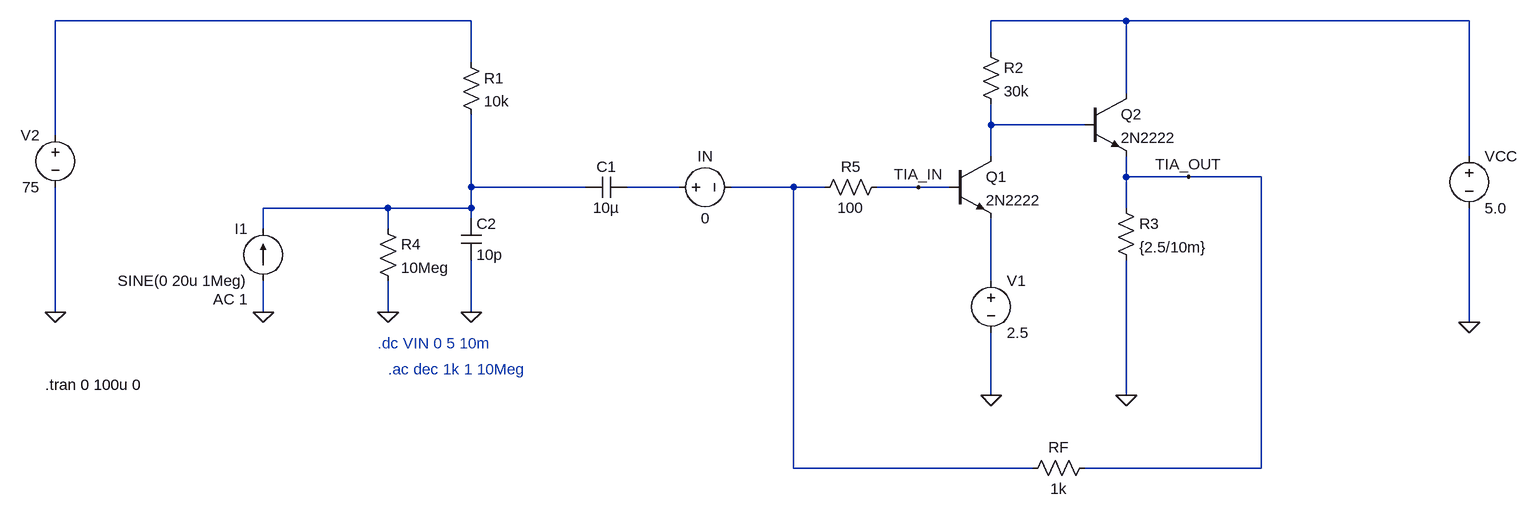
[diagram p0: schematic TIA_Improved.asc]
TIA_Improved.asc, the LTspice schematic file:
Version 4.1
SHEET 1 1100 704
WIRE -608 -32 -1248 -32
WIRE 400 -32 192 -32
WIRE 928 -32 400 -32
WIRE 192 16 192 -32
WIRE -608 32 -608 -32
WIRE 400 80 400 -32
WIRE 192 128 192 96
WIRE 336 128 192 128
WIRE -1248 144 -1248 -32
WIRE 192 176 192 128
WIRE 928 176 928 -32
WIRE 400 208 400 176
WIRE 496 208 400 208
WIRE 608 208 496 208
WIRE -608 224 -608 112
WIRE -432 224 -608 224
WIRE -288 224 -368 224
WIRE -112 224 -208 224
WIRE -64 224 -112 224
WIRE 80 224 16 224
WIRE 128 224 80 224
WIRE -736 256 -928 256
WIRE -608 256 -608 224
WIRE -608 256 -736 256
WIRE 400 256 400 208
WIRE -608 272 -608 256
WIRE -928 288 -928 256
WIRE -736 288 -736 256
WIRE 192 368 192 272
WIRE -1248 416 -1248 224
WIRE -928 416 -928 368
WIRE -736 416 -736 368
WIRE -608 416 -608 336
WIRE 928 432 928 256
WIRE 192 544 192 448
WIRE 400 544 400 336
WIRE -112 656 -112 224
WIRE 256 656 -112 656
WIRE 608 656 608 208
WIRE 608 656 336 656
FLAG 928 432 0
FLAG 192 544 0
FLAG 400 544 0
FLAG -608 416 0
FLAG 80 224 TIA_IN
FLAG 496 208 TIA_OUT
FLAG -1248 416 0
FLAG -736 416 0
FLAG -928 416 0
SYMBOL voltage 928 160 R0
WINDOW 123 0 0 Left 0
WINDOW 39 0 0 Left 0
SYMATTR InstName VCC
SYMATTR Value 5.0
SYMBOL npn 128 176 R0
SYMATTR InstName Q1
SYMATTR Value 2N2222
SYMBOL npn 336 80 R0
SYMATTR InstName Q2
SYMATTR Value 2N2222
SYMBOL res 240 672 R270
WINDOW 0 32 56 VTop 2
WINDOW 3 0 56 VBottom 2
SYMATTR InstName RF
SYMATTR Value 1k
SYMBOL voltage 192 352 R0
WINDOW 123 0 0 Left 0
WINDOW 39 0 0 Left 0
SYMATTR InstName V1
SYMATTR Value 2.5
SYMBOL voltage -304 224 R270
WINDOW 0 32 56 VTop 2
WINDOW 3 -32 56 VBottom 2
WINDOW 123 0 0 Left 0
WINDOW 39 0 0 Left 0
SYMATTR InstName IN
SYMATTR Value 0
SYMBOL cap -368 208 R90
WINDOW 0 0 32 VBottom 2
WINDOW 3 32 32 VTop 2
SYMATTR InstName C1
SYMATTR Value 10µ
SYMBOL voltage -1248 128 M0
WINDOW 123 0 0 Left 0
WINDOW 39 0 0 Left 0
SYMATTR InstName V2
SYMATTR Value 75
SYMBOL res -624 16 R0
SYMATTR InstName R1
SYMATTR Value 10k
SYMBOL cap -624 272 R0
SYMATTR InstName C2
SYMATTR Value 10p
SYMBOL res -752 272 R0
SYMATTR InstName R4
SYMATTR Value 10Meg
SYMBOL current -928 368 R180
WINDOW 0 24 80 Left 2
WINDOW 3 24 0 Left 2
WINDOW 123 24 -28 Left 2
WINDOW 39 0 0 Left 0
SYMATTR InstName I1
SYMATTR Value SINE(0 20u 1Meg)
SYMATTR Value2 AC 1
SYMBOL res -80 240 R270
WINDOW 0 32 56 VTop 2
WINDOW 3 0 56 VBottom 2
SYMATTR InstName R5
SYMATTR Value 100
SYMBOL res 176 0 R0
SYMATTR InstName R2
SYMATTR Value 30k
SYMBOL res 384 240 R0
SYMATTR InstName R3
SYMATTR Value {2.5/10m}
TEXT -752 464 Left 2 ;.dc VIN 0 5 10m
TEXT -736 504 Left 2 ;.ac dec 1k 1 10Meg
TEXT -1264 528 Left 2 !.tran 0 100u 0

The netlist it stands for:
* TIA_Improved.asc
VCC N002 0 5.0
Q1 N003 TIA_IN N007 0 2N2222
Q2 N002 N003 TIA_OUT 0 2N2222
RF N006 TIA_OUT 1k
V1 N007 0 2.5
V§IN N005 N006 0
C1 N005 N004 10µ
V2 N001 0 75
R1 N001 N004 10k
C2 N004 0 10p
R4 N004 0 10Meg
I1 0 N004 SINE(0 20u 1Meg) AC 1
R5 N006 TIA_IN 100
R2 N002 N003 30k
R3 TIA_OUT 0 {2.5/10m}
.model NPN NPN
.model PNP PNP
.lib standard.bjt
* .dc VIN 0 5 10m
* .ac dec 1k 1 10Meg
.tran 0 100u 0
.backanno
.end